# Altium schematic sheet USB.SchDoc
size A; SheetNumber: 5; SheetTotal: 7
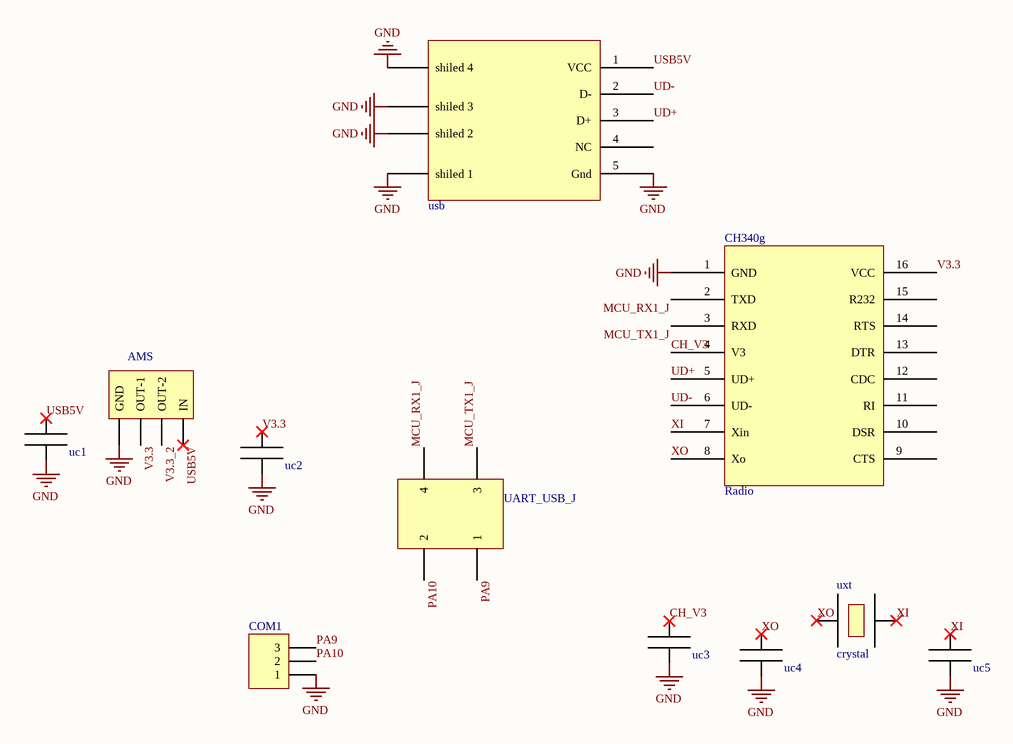
[diagram p0: USB.SchDoc]

## Parts
AMS  Regulator  [abr_fp_SOT-223_3d]  (value not drawn)
CH340g  Radio  [abr_usb_ch344g_3d]
COM1  Header 3  [HDR1X3]  (value not drawn)
UART_USB_J  pin header 2mm  [abr_ph_2x2_2mm_3d_male]  (value not drawn)
uc1  1uf  [abr_cap_0805_3d]  (value not drawn)
uc2  1uf  [abr_cap_0805_3d]  (value not drawn)
uc3  100nf  [abr_cap_0805_3d]  (value not drawn)
uc4  22pf  [abr_cap_0805_3d]  (value not drawn)
uc5  22pf  [abr_cap_0805_3d]  (value not drawn)
usb  usb connector  [abr_usb_micro_hoawey_p6_3d]  (value not drawn)
uxt  crystal  [abr_crystal_dip_3d]

## Nets
GND: AMS.1(GND) CH340g.1(GND) COM1.1 uc1.0 uc2.0 uc3.0 uc4.0 uc5.0 usb.5(Gnd) usb.6(shiled_1) usb.7(shiled_2) usb.8(shiled_3) usb.9(shiled_4)
CH_V3: CH340g.4(V3) uc3.1
MCU_RX1_J: CH340g.2(TXD) UART_USB_J.4
MCU_TX1_J: CH340g.3(RXD) UART_USB_J.3
PA9: COM1.3 UART_USB_J.1
PA10: COM1.2 UART_USB_J.2
UD+: CH340g.5(UD+) usb.3(D+)
UD-: CH340g.6(UD-) usb.2(D-)
USB5V: AMS.3(IN) uc1.1 usb.1(VCC)
V3.3: AMS.2(OUT-1) CH340g.16(VCC) uc2.1
V3.3_2: AMS.4(OUT-2)
XI: CH340g.7(Xin) uc5.1 uxt.2
XO: CH340g.8(Xo) uc4.1 uxt.1

Not connected (* = marked no-connect by the designer): CH340g 9(CTS) 10(DSR) 11(RI) 12(CDC) 13(DTR) 14(RTS) 15(R232); usb 4(NC)

## Library data of the parts
AMS = abr_reg_AMS1117
CH340g = abr_usb_ch340g
COM1 = Header 3: Header, 3-Pin; LatestRevisionDate: 17-Jul-2002; LatestRevisionNote: Re-released for DXP Platform.; Publisher: Altium Limited
UART_USB_J = abr_2x2_2mm
uc1-uc5 = abr_cap_0805
usb = abr_usb_micro_female
uxt = abr_crystal